# EAGLE board main (EAGLE 9.3.0), part 1 of 2
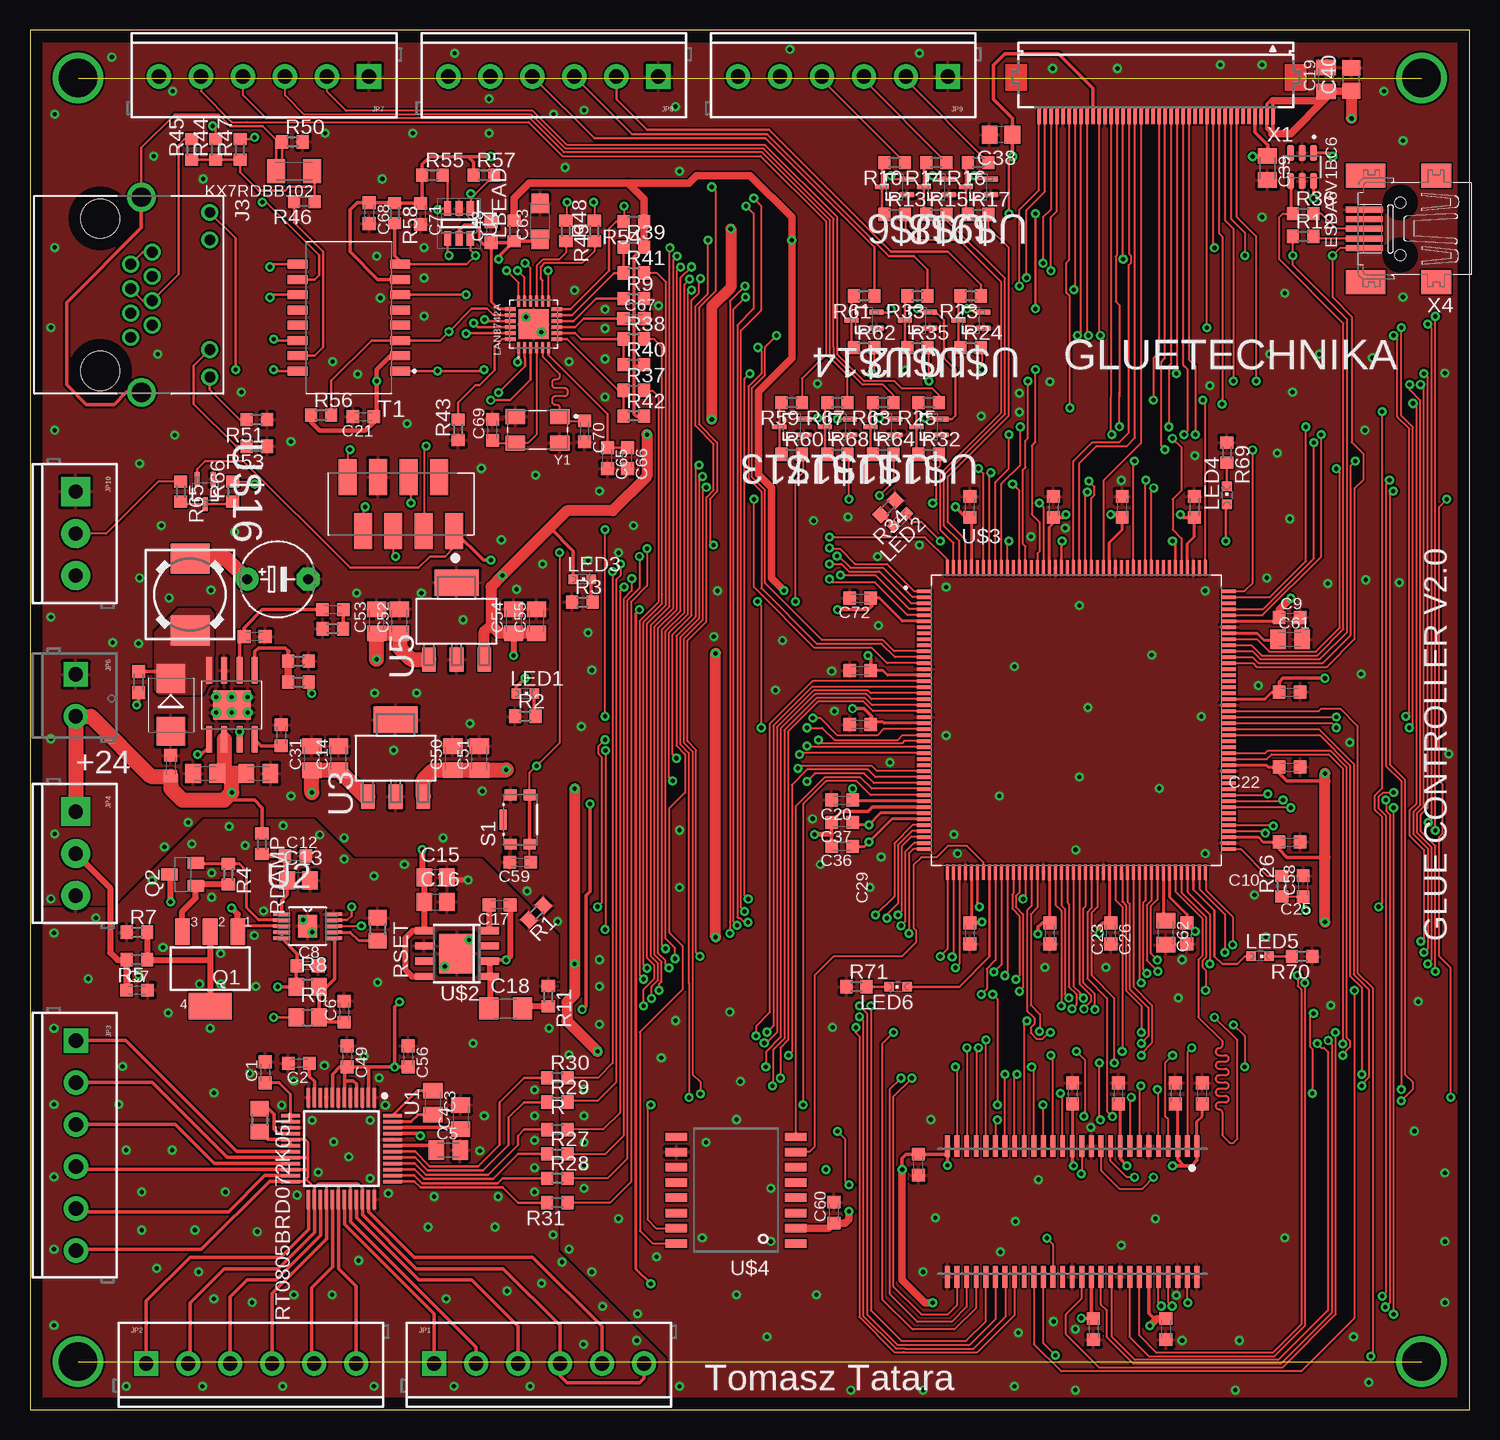
[diagram p9: board, top side]
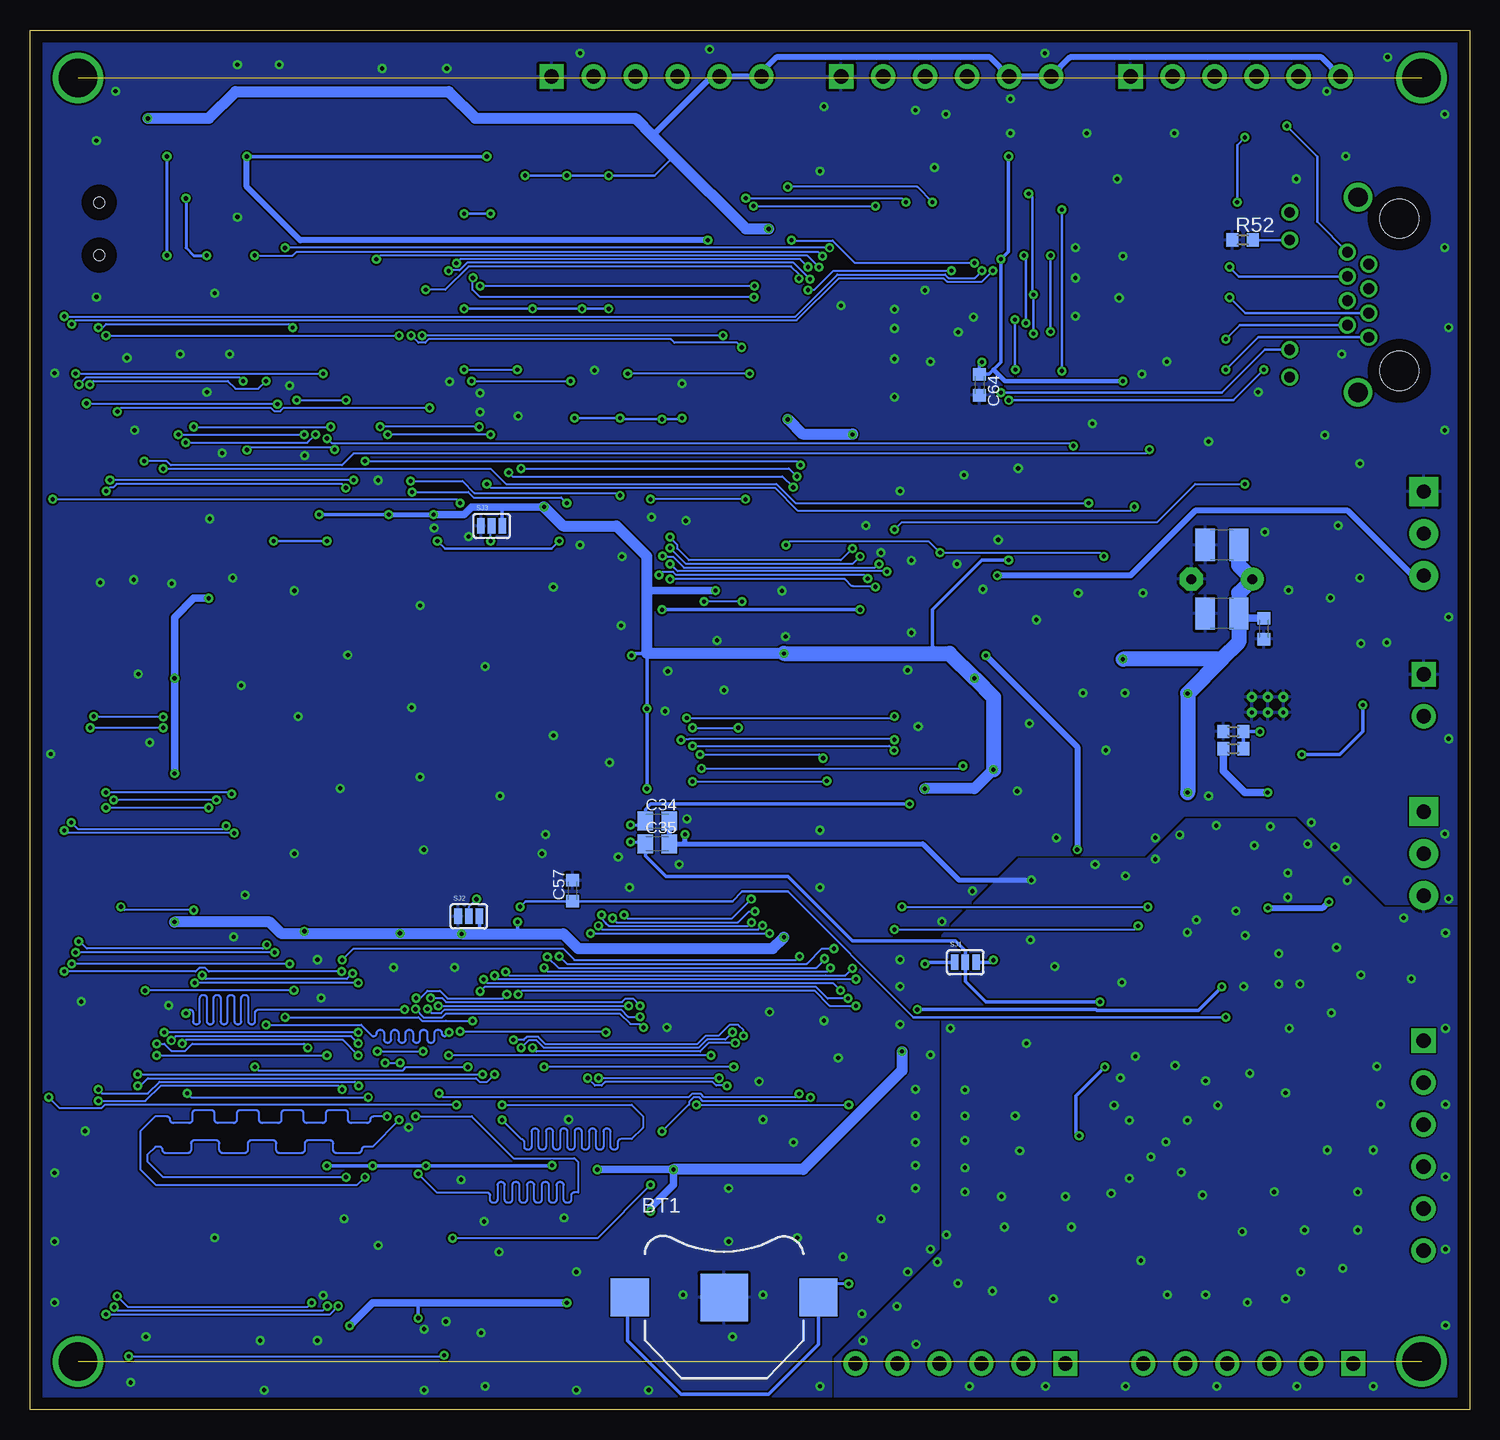
[diagram p10: board, bottom side, seen from below]

Size 120 x 115 mm. Coordinates in mm from the lower left corner, seen from the top.
Outline: 0,0 120,0 120,115 0,115 0,0
Copper layers (1*16): Top 0.035mm / dielectric 1.5mm / Bottom 0.035mm
Design rules "default": minimum track width 6mil, minimum drill 0.35mm, track to track 6mil, track to pad 6mil, pad to pad 6mil, via to via 6mil, smd to smd 6mil, copper to edge 40mil, drill to drill 6mil, minimum pad ring 10mil, minimum via ring 8mil, stop-mask expansion 4mil, vias tented up to drill 0mil, thermal gap 10mil

## Footprints (pad centres in the part's own frame; a part is rotated, then mirrored left to right if it is on the bottom)
BAT_3000TR = smd 3.18 x 3.18: 1 -7.87,0; 3 7.87,0 | smd 3.96 x 3.96: 2 0,0
C0603K = smd 1.05 x 1.08: 1 -0.875,0; 2 0.875,0
C0805K = smd 1.3 x 1.6: 1 -1,0; 2 1,0
C0805 = smd 1.3 x 1.5: 1 -0.95,0; 2 0.95,0
C1206 = smd 1.6 x 1.8: 1 -1.4,0; 2 1.4,0
SMC_A = smd 1.6 x 1.4: + -1.5,0; - 1.5,0
E5-6 = drill 0.813 pad 1.905: + -2.54,0 | drill 0.813 pad 1.905 octagon: - 2.54,0
C1210 = smd 1.6 x 2.7: 1 -1.4,0; 2 1.4,0
SMB = smd 2.4 x 2.4: A 2.2,0; C -2.2,0
SOT95P280X145-6N = smd 1.36 x 0.6: 1 -1.175,0.95; 2 -1.175,0; 3 -1.175,-0.95; 4 1.175,-0.95; 5 1.175,0; 6 1.175,0.95
AMPHENOL_RJHSE-5381 = drill 0.9: 1 3.55,2.54; 2 2.53,4.32; 3 1.52,2.54; 4 0.5,4.32; 5 -0.51,2.54; 6 -1.53,4.32; 7 -2.54,2.54; 8 -3.56,4.32; 9 6.86,9.14; 10 4.57,9.14; 11 -4.57,9.14; 12 -6.86,9.14 | drill 1.6: S1 8.13,3.43; S2 -8.13,3.43 | hole 3.25: 6.35,0; -6.35,0
SCREWTERMINAL-3.5MM-6 = drill 1.2 pad 2.032 square: 1 0,0 | drill 1.2 pad 2.032: 2 3.5,0; 3 7,0; 4 10.5,0; 5 14,0; 6 17.5,0
SCREWTERMINAL-3.5MM-3 = drill 1.2 pad 2.413 square: 1 0,0 | drill 1.2 pad 2.413: 2 3.5,0; 3 7,0
SCREWTERMINAL-3.5MM-2-NS = drill 1.2 pad 2.032 square: 1 0,0 | drill 1.2 pad 2.032: 2 3.5,0
C1206K = smd 1.5 x 2: 1 -1.5,0; 2 1.5,0
DR74 = smd 2.5 x 3.25: 1 -3,0; 2 3,0
QFN50P400X400X100-25N = smd 0.86 x 0.26: 1 -1.935,1.25; 2 -1.935,0.75; 3 -1.935,0.25; 4 -1.935,-0.25; 5 -1.935,-0.75; 6 -1.935,-1.25; 13 1.935,-1.25; 14 1.935,-0.75; 15 1.935,-0.25; 16 1.935,0.25; 17 1.935,0.75; 18 1.935,1.25 | smd 0.26 x 0.86: 7 -1.25,-1.935; 8 -0.75,-1.935; 9 -0.25,-1.935; 10 0.25,-1.935; 11 0.75,-1.935; 12 1.25,-1.935; 19 1.25,1.935; 20 0.75,1.935; 21 0.25,1.935; 22 -0.25,1.935; 23 -0.75,1.935; 24 -1.25,1.935 | smd 2.5 x 2.5: 25 0,0
R0603 = smd 1 x 1.1: 1 -0.85,0; 2 0.85,0
CHIPLED_0603 = smd 0.8 x 0.8: A 0,-0.75; C 0,0.75
SOT223 = smd 1.219 x 2.235: 1 -2.311,-3.099; 2 0,-3.099; 3 2.311,-3.099 | smd 3.6 x 2.2: 4 0,3.099
SOT23-BEC = smd 1 x 1.4: B -0.95,-1.1; C 0,1.1; E 0.95,-1.1
R0805 = smd 1.3 x 1.5: 1 -0.95,0; 2 0.95,0
SW_KMR221GLFS = smd 0.9 x 1: 1 -2.05,0.8; 2 -2.05,-0.8; 3 2.05,-0.8; 4 2.05,0.8 | smd 1.7 x 0.55: 5 0,1.425
SJ_3 = smd 0.635 x 1.27: 1 -0.889,0; 2 0,0; 3 0.889,0
XFMR_H1102NLT = smd 1.67 x 0.76: 1 -4.265,4.445; 2 -4.265,3.175; 3 -4.265,1.905; 4 -4.265,0.635; 5 -4.265,-0.635; 6 -4.265,-1.905; 7 -4.265,-3.175; 8 -4.265,-4.445; 9 4.265,-4.445; 10 4.265,-3.175; 11 4.265,-1.905; 12 4.265,-0.635; 13 4.265,0.635; 14 4.265,1.905; 15 4.265,3.175; 16 4.265,4.445
QFP50P900X900X160-48N = smd 1.6 x 0.3: 1 -4.25,2.75; 2 -4.25,2.25; 3 -4.25,1.75; 4 -4.25,1.25; 5 -4.25,0.75; 6 -4.25,0.25; 7 -4.25,-0.25; 8 -4.25,-0.75; 9 -4.25,-1.25; 10 -4.25,-1.75; 11 -4.25,-2.25; 12 -4.25,-2.75; 25 4.25,-2.75; 26 4.25,-2.25; 27 4.25,-1.75; 28 4.25,-1.25; 29 4.25,-0.75; 30 4.25,-0.25; 31 4.25,0.25; 32 4.25,0.75; 33 4.25,1.25; 34 4.25,1.75; 35 4.25,2.25; 36 4.25,2.75 | smd 0.3 x 1.6: 13 -2.75,-4.25; 14 -2.25,-4.25; 15 -1.75,-4.25; 16 -1.25,-4.25; 17 -0.75,-4.25; 18 -0.25,-4.25; 19 0.25,-4.25; 20 0.75,-4.25; 21 1.25,-4.25; 22 1.75,-4.25; 23 2.25,-4.25; 24 2.75,-4.25; 37 2.75,4.25; 38 2.25,4.25; 39 1.75,4.25; 40 1.25,4.25; 41 0.75,4.25; 42 0.25,4.25; 43 -0.25,4.25; 44 -0.75,4.25; 45 -1.25,4.25; 46 -1.75,4.25; 47 -2.25,4.25; 48 -2.75,4.25
SOP50P490X120-15N = smd 1.422 x 0.279: 1 -2.184,0.991; 2 -2.184,0.508; 3 -2.184,0; 4 -2.184,-0.508; 5 -2.184,-0.991; 6 2.184,-0.991; 7 2.184,-0.508; 8 2.184,0; 9 2.184,0.508; 10 2.184,0.991 | smd 1.575 x 1.88: 11 0,0
SOT230P700X180-4N = smd 2.032 x 1.143: 1 -3.2,2.311; 2 -3.2,0; 3 -3.2,-2.311 | smd 2.2 x 3.7: 4 3.2,0
SOT95P280X145-6N' = smd 1.2 x 0.6: 1 -1.25,0.95; 2 -1.25,0; 3 -1.25,-0.95; 4 1.25,-0.95; 5 1.25,0; 6 1.25,0.95
SOIC127P600X170-9N = smd 2.2 x 0.5: 1 -2.875,1.905; 2 -2.875,0.635; 3 -2.875,-0.635; 4 -2.875,-1.905; 5 2.875,-1.905; 6 2.875,-0.635; 7 2.875,0.635; 8 2.875,1.905 | smd 2.4 x 3.1: 9 0,0 | drill 0.33 pad 0.5: 10 -0.65,1.3; 11 0.65,1.3; 12 -0.65,0; 13 0.65,0; 14 -0.65,-1.3; 15 0.65,-1.3
TSOP54 = smd 0.4 x 1.8: 1 -10.4,-5.45; 2 -9.6,-5.45; 3 -8.8,-5.45; 4 -8,-5.45; 5 -7.2,-5.45; 6 -6.4,-5.45; 7 -5.6,-5.45; 8 -4.8,-5.45; 9 -4,-5.45; 10 -3.2,-5.45; 11 -2.4,-5.45; 12 -1.6,-5.45; 13 -0.8,-5.45; 14 0,-5.45; 15 0.8,-5.45; 16 1.6,-5.45; 17 2.4,-5.45; 18 3.2,-5.45; 19 4,-5.45; 20 4.8,-5.45; 21 5.6,-5.45; 22 6.4,-5.45; 23 7.2,-5.45; 24 8,-5.45; 25 8.8,-5.45; 26 9.6,-5.45; 27 10.4,-5.45; 28 10.4,5.45; 29 9.6,5.45; 30 8.8,5.45; 31 8,5.45; 32 7.2,5.45; 33 6.4,5.45; 34 5.6,5.45; 35 4.8,5.45; 36 4,5.45; 37 3.2,5.45; 38 2.4,5.45; 39 1.6,5.45; 40 0.8,5.45; 41 0,5.45; 42 -0.8,5.45; 43 -1.6,5.45; 44 -2.4,5.45; 45 -3.2,5.45; 46 -4,5.45; 47 -4.8,5.45; 48 -5.6,5.45; 49 -6.4,5.45; 50 -7.2,5.45; 51 -8,5.45; 52 -8.8,5.45; 53 -9.6,5.45; 54 -10.4,5.45
SOIC8 = smd 0.6 x 1.5: 1 -1.905,-2.75; 2 -0.635,-2.75; 3 0.635,-2.75; 4 1.905,-2.75; 5 1.905,2.75; 6 0.635,2.75; 7 -0.635,2.75; 8 -1.905,2.75 | smd 3.3 x 2.95: E 0,0
QFP50P2600X2600X160-176N = smd 0.3 x 1.3: BOOT0 -5.75,12.68; BYPASS_REG -9.25,-12.68; PA3 -9.75,-12.68; PA4 -8.25,-12.68; PA5 -7.75,-12.68; PA6 -7.25,-12.68; PA7 -6.75,-12.68; PA14 8.75,12.68; PA15 8.25,12.68; PB0 -5.25,-12.68; PB1 -4.75,-12.68; PB2/BOOT1 -4.25,-12.68; PB3 -3.25,12.68; PB4 -3.75,12.68; PB5 -4.25,12.68; PB6 -4.75,12.68; PB7 -5.25,12.68; PB8 -6.25,12.68; PB9 -6.75,12.68; PB10 6.25,-12.68; PB11 6.75,-12.68; PC4 -6.25,-12.68; PC5 -5.75,-12.68; PC10 7.75,12.68; PC11 7.25,12.68; PC12 6.75,12.68; PD0 6.25,12.68; PD1 5.75,12.68; PD2 5.25,12.68; PD3 4.75,12.68; PD4 4.25,12.68; PD5 3.75,12.68; PD6 2.25,12.68; PD7 1.75,12.68; PDR_ON -8.25,12.68; PE0 -7.25,12.68; PE1 -7.75,12.68; PE7 0.75,-12.68; PE8 1.25,-12.68; PE9 1.75,-12.68; PE10 3.25,-12.68; PE11 3.75,-12.68; PE12 4.25,-12.68; PE13 4.75,-12.68; PE14 5.25,-12.68; PE15 5.75,-12.68; PF11 -3.75,-12.68; PF12 -3.25,-12.68; PF13 -1.75,-12.68; PF14 -1.25,-12.68; PF15 -0.75,-12.68; PG0 -0.25,-12.68; PG1 0.25,-12.68; PG9 1.25,12.68; PG10 0.75,12.68; PG11 0.25,12.68; PG12 -0.25,12.68; PG13 -0.75,12.68; PG14 -1.25,12.68; PG15 -2.75,12.68; PH4 -10.75,-12.68; PH5 -10.25,-12.68; PH6 8.25,-12.68; PH7 8.75,-12.68; PH8 9.25,-12.68; PH9 9.75,-12.68; PH10 10.25,-12.68; PH11 10.75,-12.68; PI2 10.75,12.68; PI3 10.25,12.68; PI4 -9.25,12.68; PI5 -9.75,12.68; PI6 -10.25,12.68; PI7 -10.75,12.68; VCAP_1 7.25,-12.68; VDD@4 -8.75,-12.68; VDD@5 -2.25,-12.68; VDD@6 2.75,-12.68; VDD@7 7.75,-12.68; VDD@12 9.25,12.68; VDD@13 2.75,12.68; VDD@14 -2.25,12.68; VDD@15 -8.75,12.68; VSS@3 -2.75,-12.68; VSS@4 2.25,-12.68; VSS@10 9.75,12.68; VSS@11 3.25,12.68; VSS@12 -1.75,12.68 | smd 1.3 x 0.3: NRST -12.68,-4.25; PA0 -12.68,-8.75; PA1 -12.68,-9.25; PA2 -12.68,-9.75; PA8 12.68,4.25; PA9 12.68,4.75; PA10 12.68,5.25; PA11 12.68,5.75; PA12 12.68,6.25; PA13 12.68,6.75; PB12 12.68,-9.25; PB13 12.68,-8.75; PB14 12.68,-8.25; PB15 12.68,-7.75; PC0 -12.68,-4.75; PC1 -12.68,-5.25; PC2 -12.68,-5.75; PC3 -12.68,-6.25; PC6 12.68,2.25; PC7 12.68,2.75; PC8 12.68,3.25; PC9 12.68,3.75; PC13 -12.68,7.25; PC14 -12.68,6.75; PC15 -12.68,6.25; PD8 12.68,-7.25; PD9 12.68,-6.75; PD10 12.68,-6.25; PD11 12.68,-5.75; PD12 12.68,-5.25; PD13 12.68,-4.75; PD14 12.68,-3.25; PD15 12.68,-2.75; PE2 -12.68,10.75; PE3 -12.68,10.25; PE4 -12.68,9.75; PE5 -12.68,9.25; PE6 -12.68,8.75; PF0 -12.68,3.25; PF1 -12.68,2.75; PF2 -12.68,2.25; PF3 -12.68,1.75; PF4 -12.68,1.25; PF5 -12.68,0.75; PF6 -12.68,-0.75; PF7 -12.68,-1.25; PF8 -12.68,-1.75; PF9 -12.68,-2.25; PF10 -12.68,-2.75; PG2 12.68,-2.25; PG3 12.68,-1.75; PG4 12.68,-1.25; PG5 12.68,-0.75; PG6 12.68,-0.25; PG7 12.68,0.25; PG8 12.68,0.75; PH0 -12.68,-3.25; PH1 -12.68,-3.75; PH2 -12.68,-10.25; PH3 -12.68,-10.75; PH12 12.68,-10.75; PH13 12.68,8.75; PH14 12.68,9.25; PH15 12.68,9.75; PI0 12.68,10.25; PI1 12.68,10.75; PI8 -12.68,7.75; PI9 -12.68,5.75; PI10 -12.68,5.25; PI11 -12.68,4.75; VBAT -12.68,8.25; VCAP_2 12.68,7.25; VDD@1 -12.68,3.75; VDD@2 -12.68,-0.25; VDD@3 -12.68,-6.75; VDD@8 12.68,-9.75; VDD@9 12.68,-3.75; VDD@10 12.68,1.75; VDD@11 12.68,8.25; VDDA -12.68,-8.25; VREF -12.68,-7.75; VSS@1 -12.68,4.25; VSS@2 -12.68,0.25; VSS@5 12.68,-10.25; VSS@7 12.68,-4.25; VSS@8 12.68,1.25; VSS@9 12.68,7.75; VSSA -12.68,-7.25
SOIC16 = smd 0.7 x 1.8: 1 -4.445,-4.977; 2 -3.175,-4.977; 3 -1.905,-4.977; 4 -0.635,-4.977; 5 0.635,-4.977; 6 1.905,-4.977; 7 3.175,-4.977; 8 4.445,-4.977; 9 4.445,4.977; 10 3.175,4.977; 11 1.905,4.977; 12 0.635,4.977; 13 -0.635,4.977; 14 -1.905,4.977; 15 -3.175,4.977; 16 -4.445,4.977
MICROMATCH_8 = smd 1.5 x 3: 1 -5.715,2.25; 2 -4.445,-2.25; 3 -3.175,2.25; 4 -1.905,-2.25; 5 -0.635,2.25; 6 0.635,-2.25; 7 1.905,2.25; 8 3.175,-2.25
SOT65P210X110-3N = smd 1.168 x 0.406: 1 -1.041,0.66; 2 -1.041,-0.66; 3 1.041,0
FH12-40S-0.5SH = smd 0.3 x 1.3: 1 -9.75,3.25; 2 -9.25,3.25; 3 -8.75,3.25; 4 -8.25,3.25; 5 -7.75,3.25; 6 -7.25,3.25; 7 -6.75,3.25; 8 -6.25,3.25; 9 -5.75,3.25; 10 -5.25,3.25; 11 -4.75,3.25; 12 -4.25,3.25; 13 -3.75,3.25; 14 -3.25,3.25; 15 -2.75,3.25; 16 -2.25,3.25; 17 -1.75,3.25; 18 -1.25,3.25; 19 -0.75,3.25; 20 -0.25,3.25; 21 0.25,3.25; 22 0.75,3.25; 23 1.25,3.25; 24 1.75,3.25; 25 2.25,3.25; 26 2.75,3.25; 27 3.25,3.25; 28 3.75,3.25; 29 4.25,3.25; 30 4.75,3.25; 31 5.25,3.25; 32 5.75,3.25; 33 6.25,3.25; 34 6.75,3.25; 35 7.25,3.25; 36 7.75,3.25; 37 8.25,3.25; 38 8.75,3.25; 39 9.25,3.25; 40 9.75,3.25
32005-201 = smd 3.1 x 0.5: 1 3,1.6; 2 3,0.8; 3 3,0; 4 3,-0.8; 5 3,-1.6 | smd 2.5 x 2: M1 -3,-4.45; M2 -3,4.45 | smd 3.3 x 2: M3 2.9,4.45; M4 2.9,-4.45 | hole 0.9: 0,2.2; 0,-2.2
XTAL_ECS-250-20-30B-TR = smd 1.6 x 1.25: 1 -1.85,-1.1; 2 1.85,-1.1; 3 1.85,1.1; 4 -1.85,1.1

## Placement (x,y rotation side)
BT1  3000TR  [BAT_3000TR]  62.13,9.34 0 bottom
C1  1u  [C0603K]  19.62,28.11 90 top
C2  100n  [C0603K]  22.41,28.87 180 top
C3  10u  [C0805K]  33.59,25.57 270 top
C4  10u  [C0805K]  35.9,24.38 90 top
C5  10u  [C0805K]  34.86,21.63 0 top
C6  100n  [C0603K]  26.19,33.18 90 top
C7  10n  [C0603K]  8.92,34.96 0 top
C8  470n  [C0603K]  23.15,36.99 0 top
C9  100n  [C0603K]  105.01,66.04 0 top
C10  100n  [C0603K]  105.01,47.31 0 top
C11  100n  [C0603K]  85.01,39.69 270 top
C12  100n  [C0603K]  22.13,46.13 0 top
C13  10u  [C0805]  22.38,44.1 0 top
C14  10u  [C0805K]  25.72,54.29 90 top
C15  1u  [C0805]  33.81,44.36 0 top
C16  10u  [C0805]  33.81,42.32 0 top
C17  10n  [C0603K]  39.15,42.07 180 top
C18  22u  [C1206]  39.66,33.43 0 top
C19  2u2  [C0805K]  108.04,110.89 90 top
C20  100n  [C0603K]  67.71,50.8 180 top
C21  100n  [C0603K]  27.8,82.76 180 top
C22  100n  [C0603K]  105.01,59.8 0 top
C23  100n  [C0603K]  96.44,39.69 270 top
C24  100n  [C0603K]  97.08,75.25 90 top
C25  100n  [C0603K]  105.01,53.55 0 top
C26  100n  [C0603K]  90.09,39.69 270 top
C27  100n  [C0603K]  69.22,57.12 180 top
C28  100n  [C0603K]  78.34,75.25 90 top
C29  100n  [C0603K]  78.34,39.69 270 top
C30  100n  [C0603K]  85.33,75.25 90 top
C31  [C0805K]  23.5,54.29 90 top
C32  100n  [C0603K]  69.22,61.6 180 top
C33  100n  [C0603K]  91.04,75.25 90 top
C34  1u  [C0805K]  67.71,49.05 0 bottom
C35  1u  [C0805K]  67.71,47.15 0 bottom
C36  100n  [C0603K]  67.71,46.96 180 top
C37  100n  [C0603K]  67.71,48.93 180 top
C38  100n  [C0805]  80.95,106.27 180 top
C39  2u2  [C0805K]  103.16,103.49 270 top
C40  100n  [C0805]  110.14,110.89 90 top
C41  100n  [C0603K]  88.66,6.7 270 top
C42  100n  [C0603K]  94.69,6.7 270 top
C43  100n  [C0603K]  97.71,26.35 90 top
C44  100n  [C0603K]  74.06,20.41 270 top
C45  100n  [C0603K]  95.49,26.35 90 top
C46  100n  [C0603K]  86.92,26.35 90 top
C47  100n  [C0603K]  90.72,26.35 90 top
C48  100n  [C0603K]  38.45,98.15 90 top
C49  100n  [C0603K]  26.45,29.43 270 top
C50  10u  [C0805K]  35.24,54.29 90 top
C51  2u2  [C0805K]  37.47,54.29 90 top
C52  10u  [C0805K]  30.8,65.72 90 top
C53  [C0805K]  28.89,65.72 90 top
C54  10u  [C0805K]  40.32,65.72 90 top
C55  2u2  [C0805K]  42.23,65.72 90 top
C56  100n  [C0603K]  31.53,29.43 270 top
C57  100n  [C0603K]  74.77,43.24 90 bottom
C58  100n  [C0603K]  106.13,43.62 90 top
C59  100n  [C0603K]  40.86,45.63 180 top
C60  100n  [C0603K]  67,16.41 90 top
C61  2u2  [C0805K]  105.05,64.2 0 top
C62  2u2  [C0805K]  94.68,39.73 270 top
C63  [SMC_A]  42.51,99.05 90 top
C64  100n  [C0603K]  40.85,85.42 270 bottom
C65  1u  [C0603K]  48.13,79.31 270 top
C66  470p  [C0603K]  49.8,79.31 270 top
C67  100n  [C0603K]  50.33,90.92 0 top
C68  100n  [C0603K]  28.29,99.73 270 top
C69  18p  [C0603K]  38.55,81.67 90 top
C70  18p  [C0603K]  46.23,81.53 270 top
C71  100n  [C0603K]  32.57,99.66 270 top
C72  100n  [C0603K]  69.22,67.63 180 top
C84  10n  [C0603K]  20.95,56.2 90 top
C85  4u7  [C0805K]  19.05,53.02 0 top
C86  4u7  [C0805K]  14.61,53.02 180 top
C87  100n  [C0603K]  11.75,53.66 90 top
C88  2n2  [C0603K]  25.24,66.67 0 top
C89  22n  [C0603K]  18.73,64.45 0 top
C90  100n  [C0603K]  9.05,60.64 90 top
C91  [E5-6]  20.64,69.22 0 top
C92  47u  [C1210]  20.64,72.07 180 bottom
C93  1u  [C0603K]  17.14,65.09 270 bottom
C94  47u  [C1210]  20.64,66.36 180 bottom
D1  CDBC540-G  [SMB]  11.75,58.74 270 top
ESDA6V1BC6  ESDA6V1SC6  [SOT95P280X145-6N]  106.05,103.58 270 top
J3  RJHSE-5381  [AMPHENOL_RJHSE-5381]  5.86,92.93 270 top
JP1  [SCREWTERMINAL-3.5MM-6]  33.69,3.84 0 top
JP2  [SCREWTERMINAL-3.5MM-6]  9.68,3.84 0 top
JP3  [SCREWTERMINAL-3.5MM-6]  3.84,30.76 270 top
JP4  [SCREWTERMINAL-3.5MM-3]  3.81,49.85 270 top
JP6  [SCREWTERMINAL-3.5MM-2-NS]  3.81,61.28 270 top
JP7  [SCREWTERMINAL-3.5MM-6]  28.26,111.12 180 top
JP8  [SCREWTERMINAL-3.5MM-6]  52.39,111.12 180 top
JP9  [SCREWTERMINAL-3.5MM-6]  76.52,111.12 180 top
JP10  [SCREWTERMINAL-3.5MM-3]  3.81,76.52 270 top
KX7RDBB102  1n  [C1206K]  22.02,103.21 180 top
L1  ASPI-0630LR-4R7M-T15  [DR74]  13.34,67.94 90 top
LAN8742A  LAN8720A-CP  [QFN50P400X400X100-25N]  41.98,90.47 90 top
LBEAD  742863160  [R0603]  40.35,98.25 90 top
LED1  [CHIPLED_0603]  41.27,59.69 270 top
LED2  [CHIPLED_0603]  72.53,74.17 135 top
LED3  [CHIPLED_0603]  46.04,69.22 270 top
LED4  [CHIPLED_0603]  99.77,76.2 0 top
LED5  [CHIPLED_0603]  102.55,37.78 270 top
LED6  [CHIPLED_0603]  72.39,35.24 90 top
Q1  BSP170P  [SOT223]  15.02,36.74 180 top
Q2  MMBT2907ALT1SMD  [SOT23-BEC]  12.73,44.61 90 top
R  100  [R0603]  43.97,23.34 0 top
R1  0  [R0603]  42.21,41.41 225 top
R2  10k  [R0603]  41.27,57.78 0 top
R3  10k  [R0603]  46.04,67.31 0 top
R4  15  [R0603]  16.54,44.61 270 top
R5  10k  [R0603]  8.92,37.5 180 top
R6  5.11k 0.1  [R0805]  23.15,32.67 0 top
R7  500  [R0603]  8.92,39.78 0 top
R8  20.5k 0.1  [R0805]  23.15,35.21 0 top
R9  10k  [R0603]  50.33,92.6 0 top
R10  1k  [R0603]  72.07,103.95 180 top
R11  0.25  [R0603]  43.21,34.45 270 top
R12  22  [R0603]  106.12,97.79 0 top
R13  10  [R0603]  72.07,99.63 0 top
R14  1k  [R0603]  75.56,103.95 180 top
R15  10  [R0603]  75.56,99.63 0 top
R16  1k  [R0603]  79.06,103.95 180 top
R17  10  [R0603]  79.06,99.63 0 top
R18  330k  [R0603]  19.68,55.09 180 bottom
R19  45.3k  [R0603]  19.68,56.52 0 bottom
R20  16k  [R0603]  22.38,60.64 0 top
R21  2k67  [R0603]  22.38,62.39 180 top
R22  37k4  [R0603]  25.24,65.09 180 top
R23  1k  [R0603]  78.42,92.84 180 top
R24  10  [R0603]  78.42,88.52 0 top
R25  1k  [R0603]  74.93,83.95 180 top
R26  10k  [R0603]  104.35,43.62 90 top
R27  100  [R0603]  43.97,21.31 0 top
R28  100  [R0603]  43.97,19.27 0 top
R29  100  [R0603]  43.97,25.62 0 top
R30  100  [R0603]  43.97,27.66 0 top
R31  100  [R0603]  43.97,17.24 180 top
R32  10  [R0603]  74.93,79.63 0 top
R33  1k  [R0603]  73.98,92.84 180 top
R34  10k  [R0603]  71.52,75.18 225 top
R35  10  [R0603]  73.98,88.52 0 top
R36  22  [R0603]  106.12,99.69 0 top
R37  33  [R0603]  50.33,84.96 0 top
R38  33  [R0603]  50.33,89.25 0 top
R39  10k  [R0603]  50.33,96.89 0 top
R40  10k  [R0603]  50.33,87.1 0 top
R41  33  [R0603]  50.33,94.74 0 top
R42  10k  [R0603]  50.33,82.81 0 top
R43  12k1  [R0603]  35.69,81.67 90 top
R44  75  [R0603]  15.49,105.04 90 top
R45  75  [R0603]  13.47,105.04 90 top
R46  75  [R0603]  22.88,100.7 180 top
R47  75  [R0603]  17.52,105.04 90 top
R48  33  [R0603]  47.04,98.25 90 top
R49  0  [R0603]  44.67,98.25 270 top
R50  0  [R0603]  21.89,105.67 0 top
R51  270  [R0603]  18.91,82.52 180 top
R52  270  [R0603]  18.91,97.5 0 bottom
R53  10k  [R0603]  18.91,80.3 180 top
R54  1k5  [R0603]  50.33,99.03 180 top
R55  50  [R0603]  33.56,102.9 0 top
R56  50  [R0603]  24.27,82.89 0 top
R57  50  [R0603]  37.84,102.9 0 top
R58  50  [R0603]  30.4,99.73 270 top
R59  1k  [R0603]  63.5,83.95 180 top
R60  10  [R0603]  63.5,79.63 0 top
R61  1k  [R0603]  69.53,92.84 180 top
R62  10  [R0603]  69.53,88.52 0 top
R63  1k  [R0603]  71.12,83.95 180 top
R64  10  [R0603]  71.12,79.63 0 top
R65  1k  [R0603]  12.57,76.52 270 top
R66  10  [R0603]  16.89,76.52 90 top
R67  1k  [R0603]  67.31,83.95 180 top
R68  10  [R0603]  67.31,79.63 0 top
R69  10k  [R0603]  99.77,79.77 270 top
R70  10k  [R0603]  106.05,37.78 180 top
R71  10k  [R0603]  68.9,35.24 0 top
RDAMP  5  [R0603]  19.34,47.15 270 top
RSET  1k650 0.1  [R0805]  28.99,40.04 270 top
RT0805BRD072K05L  2050 0.1%  [R0805]  19.14,24.13 270 top
S1  KMR221GLFS  [SW_KMR221GLFS]  40.86,49.18 90 top
SJ1  [SJ_3]  42.03,37.28 0 bottom
SJ2  [SJ_3]  83.42,41.12 0 bottom
SJ3  [SJ_3]  81.52,73.66 0 bottom
T1  H1102NLT  [XFMR_H1102NLT]  26.58,91.02 180 top
U1  LTC2983CLX#PBF  [QFP50P900X900X160-48N]  25.97,21.76 270 top
U2  XTR111AIDGQR  [SOP50P490X120-15N]  23.15,40.29 0 top
U3  MCP1826S-5002E/DB  [SOT230P700X180-4N]  30.48,54.29 90 top
U4  USBLC6-4SC6  [SOT95P280X145-6N']  35.76,98.87 270 top
U5  MCP1826S-5002E/DB  [SOT230P700X180-4N]  35.56,65.72 90 top
U6  TPS54531DDA  [SOIC127P600X170-9N]  16.83,58.74 90 top
U$1  IS45S16400J  [TSOP54]  86.88,16.51 180 top
U$2  IFX5444  [SOIC8]  35.59,38.01 90 top
U$3  STM32F429_176  [QFP50P2600X2600X160-176N]  87.23,57.47 0 top
U$4  S25FLX  [SOIC16]  58.86,18.29 90 top
U$5  MICROMATCH_8  [MICROMATCH_8]  29.66,75.48 180 top
U$6  BAS40W-04  [SOT65P210X110-3N]  72.07,101.92 180 top
U$8  BAS40W-04  [SOT65P210X110-3N]  75.56,101.92 180 top
U$9  BAS40W-04  [SOT65P210X110-3N]  79.06,101.92 180 top
U$10  BAS40W-04  [SOT65P210X110-3N]  78.42,90.81 180 top
U$11  BAS40W-04  [SOT65P210X110-3N]  74.93,81.92 180 top
U$12  BAS40W-04  [SOT65P210X110-3N]  73.98,90.81 180 top
U$13  BAS40W-04  [SOT65P210X110-3N]  63.5,81.92 180 top
U$14  BAS40W-04  [SOT65P210X110-3N]  69.53,90.81 180 top
U$15  BAS40W-04  [SOT65P210X110-3N]  71.12,81.92 180 top
U$16  BAS40W-04  [SOT65P210X110-3N]  14.61,76.52 270 top
U$17  BAS40W-04  [SOT65P210X110-3N]  67.31,81.92 180 top
X1  FH12-40S-0.5SH  [FH12-40S-0.5SH]  93.86,111.05 180 top
X4  MINI-USB-32005-201  [32005-201]  114.22,98.42 180 top
Y1  ECS-250-20-30B-TR  [XTAL_ECS-250-20-30B-TR]  42.31,81.67 180 top

## Tracks (layer width: path | path; a pad name or v marks a point on that pad's centre or on a via)
6V  (via drill 0.35)
  Top 0.305: R20.2 23.23,59.95 v23.5,59.69
  Top 1.27: L1.2 16.37,70.94 C91.+ | v28.89,62.55 C53.1 C52.1 30.8,63.5 31.77,62.52 U5.1 | v23.5,51.44 C31.1 C14.1 27.92,51.09 U3.1
  Bottom 0.61: C93.1 18.84,65.96 C94.1
  Bottom 1.27: C92.1 19.24,70.36 C91.+ 19.24,68.08 C94.1 19.24,63.95 20.64,62.55 | 20.64,62.55 v28.89,62.55 | 20.64,62.55 v23.5,59.69 v23.5,51.44
!EN  (via drill 0.35)
  Top 0.305: U6.3 v17.46,56.5
  Bottom 0.305: R18.1 R19.2 17.48,56.52 v17.46,56.5
+3V3  (via drill 0.35)
  Top 0.203: LAN8742A.9 45.45,90.22 46.16,90.92 C67.1 | U$13.2 65.56,82.58 v65.64,82.65 | v67.31,82.55 68.33,82.55 U$17.2 | v70.8,82.65 72.09,82.65 U$15.2 | v74.61,82.65 74.69,82.58 U$11.2 76.86,82.58 77.15,82.87 77.15,86.68 76.2,87.63 76.2,90.81 75.54,91.47 U$12.2 74.27,91.47 v73.98,91.76 | v71.75,91.76 71.44,91.44 70.6,91.44 U$14.2 | v78.11,91.76 78.42,91.76 78.74,91.44 79.44,91.44 U$10.2 | v83.82,91.76 v83.82,99.69 | v81.6,99.69 81.6,104.14 v81.92,104.46 | U$16.2 13.95,78.4 14.61,79.06 17.78,79.06 26.67,70.17 32.38,70.17 33.34,71.12 34.61,71.12 35.37,71.88 U$5.1
  Top 0.254: U$3.VDD@11 103.81,65.72 C9.1 | U$3.VDD@10 102.95,59.22 103.53,59.8 C22.1 | U$3.VDD@9 103.05,53.72 103.21,53.55 C25.1 | U$3.VDD@8 102.38,47.72 102.79,47.31 C10.1 | U$3.VDD@12 96.48,72.19 97.08,72.78 C24.1 | U$3.VDD@13 89.98,72.28 91.04,73.34 C33.1 | C28.1 78.48,74.23 U$3.VDD@15 | U$3.VDD@5 84.98,40.59 C11.1 | C46.1 86.88,25.44 U$1.14 | U$1.9 90.88,25.32 C47.1 | U$1.3 95.68,25.29 C45.1 | U$1.1 97.28,24.02 97.71,24.45 C43.1 | U$3.VDD@4 78.48,40.7 C29.1 | U$3.VDD@6 89.98,40.67 C26.1 | U$3.VDD@7 94.98,42.73 96.44,41.27 C23.1 | U$3.VDD@3 68.66,50.72 C20.1 | U$3.VDD@1 71.5,61.22 71.12,61.6 C32.1 | U$3.VDD@2 71.21,57.22 71.12,57.31 70.28,57.31 C27.1 | U$3.VDD@14 84.98,73.55 85.33,73.9 C30.1
  Top 0.305: C20.1 v68.58,51.75 | C11.1 84.38,40.56 84.03,40.21 v84.03,39.65 | C22.1 104.14,60.64 104.46,60.96 v107.95,60.96 | C25.1 104.14,53.02 104.78,52.39 107.95,52.39 | C10.1 104.14,46.67 104.78,46.04 107.95,46.04 | C26.1 89.46,40.56 89.16,40.27 v89.16,39.7 | C27.1 70.09,57.71 70.17,57.78 69.53,58.42 v68.58,58.42 | U$1.43 88.48,7.75 C41.1 88.61,7.62 v87.63,7.62 | U$1.49 93.28,8 93.71,7.57 94.61,7.57 C42.1 | C24.1 96.12,74.37 v95.89,74.61 | U$1.9 90.88,20.88 v91.44,20.32 | U$1.3 95.68,20.84 96.2,20.32 | 96.2,20.32 96.84,20.32 97.28,20.76 U$1.1 | 96.2,20.32 v95.25,20.32 | v87,20.32 86.88,20.43 U$1.14 | 76.48,21.27 U$1.27 | 76.48,21.27 74.07,21.27 C44.1 74.04,21.27 73.03,21.27 72.71,20.95 v72.71,20 | v76.48,20.35 76.48,21.27 | X1.4 102.11,106.48 103.19,105.41 103.19,104.52 C39.1 103.13,104.46 v101.92,104.46 | LED1.A 40.52,60.21 v41.27,60.96 | X1.31 88.61,110.14 85.72,113.03 81.28,113.03 80.33,112.08 80.33,109.22 81.92,107.63 81.92,106.28 C38.1 81.9,104.47 v81.92,104.46 | R39.2 50.37,96.08 50.37,90.81 | R42.2 50.53,82.81 50.37,82.98 50.37,87 | 50.37,90.81 50.37,87 | R40.2 51.07,87 50.37,87 | C67.1 49.57,90.81 50.37,90.81 | U$5.1 37.8,70.8 v38.42,70.8 | C29.1 79.27,40.56 v79.35,40.64 | C32.1 70.09,62.62 v69.85,62.87 | C28.1 78.03,74.37 v77.15,75.25 | C33.1 90.8,74.61 v90.09,74.61 | C30.1 86.12,74.37 v86.36,74.61 | C23.1 v97.13,39.87
  Top 0.61: v105.09,67.63 104.14,66.67 C9.1 | U$4.2 66.58,15.11 C60.1 67.93,15.54 68.26,15.88 v68.26,16.51 | v72.71,20 72.71,10.79 74.61,8.89 v75.25,8.89 | v93.34,6.99 93.93,7.57 94.61,7.57 | LBEAD.2 40.35,100.99 41.59,102.23 49.85,102.23 | 49.85,102.23 51.17,100.91 R54.1 R39.2 | 49.85,102.23 54.93,102.23 55.56,102.87 60.01,102.87 63.5,99.38 v63.5,97.47 63.5,87.63 60.72,84.84 60.72,77.95 61.81,76.85 61.81,69.32 v62.87,68.26
  Top 0.914: v107.95,40.64 107.95,46.04 107.95,52.39 v107.95,53.02 | v57.15,39.37 v57.15,63.02 | v45.4,51.75 v45.4,37.15 45.4,34.61 44.77,33.97 44.77,32.38 v47.31,29.84
  Top 1.27: U3.3 32.79,52.48 33.61,53.29 C50.1 C51.1 39.64,53.29 v39.69,53.34
  Bottom 0.203: v65.64,82.65 65.73,82.55 v67.31,82.55 70.7,82.55 v70.8,82.65 v74.61,82.65 | v71.75,91.76 v73.98,91.76 v78.1,91.76 v78.11,91.76 v83.82,91.76 | v83.82,99.69 v81.6,99.69
  Bottom 0.305: v89.16,39.7 89.22,39.65 | v68.58,51.75 v68.58,58.42 68.58,63.02 69.69,63.02 v69.85,62.87 | v95.89,74.61 v90.09,74.61 | v95.25,20.32 v91.44,20.32 v87,20.32 76.51,20.32 v76.48,20.35 | v87.63,7.62 87.63,8.89 | v81.92,104.46 v101.92,104.46 | v38.42,70.8 40.64,70.8 44.77,66.67 44.77,63.02 | SJ1.1 45.27,37.28 v45.4,37.15 | SJ2.3 82.53,39.66 82.55,39.65 | SJ3.3 80.63,75.23 80.64,75.25 | v79.35,40.64 79.38,40.62 79.38,39.65 | v97.13,39.87 97.16,39.84 97.16,39.65
  Bottom 0.406: v90.09,74.61 v86.36,74.61
  Bottom 0.508: v63.5,97.47 97.47,97.47 101.92,101.92 v101.92,104.46
  Bottom 0.61: v107.95,53.02 v107.95,60.96 107.95,66.04 106.36,67.63 v105.09,67.63 | v86.36,74.61 83.82,74.61 83.19,75.25 80.64,75.25 v77.15,75.25 | v72.71,20 v66.36,20 66.36,18.73 68.26,16.83 v68.26,16.51 | v75.25,8.89 87.63,8.89 91.44,8.89 v93.34,6.99 | v62.87,68.26 68.26,68.26 68.58,67.94
  Bottom 0.914: v57.15,63.02 68.58,63.02 68.58,67.94 68.58,71.12 71.12,73.66 75.56,73.66 v77.15,75.25 | v107.95,40.64 100.01,40.64 99.02,39.65 97.16,39.65 89.22,39.65 v84.03,39.65 82.55,39.65 79.38,39.65 75.53,39.65 74.3,38.42 58.1,38.42 v57.15,39.37 | v39.69,53.34 41.27,51.75 v45.4,51.75 | v47.31,29.84 47.31,28.26 55.56,20 v66.36,20
  Bottom 1.27: v57.15,63.02 44.77,63.02 43.34,63.02 v41.27,60.96 39.69,59.37 v39.69,53.34
+5V  (via drill 0.35)
  Top 0.203: U$6.2 72.05,102.58 v71.75,102.87 | v75.25,102.87 75.54,102.58 U$8.2 | v78.74,102.87 79.06,102.55 80.07,102.55 U$9.2
  Top 0.305: LED3.A 45.29,71.55 43.34,73.5 | X1.2 103.11,108.83 103.5,109.22 103.61,109.11 X1.1 103.61,106.47 103.5,106.36 103.11,106.75 X1.2
  Top 0.508: 32.86,39.93 U$2.5 | 32.86,39.93 31.93,39.93 31.27,39.28 31.27,36.67 31.84,36.1 U$2.8 | 32.86,39.93 C16.1 C15.1 32.7,44.52 v32.7,46.67 | C54.1 v40.32,62.87
  Top 0.61: 103.61,109.11 107.27,109.11 107.98,109.82 | 107.98,109.82 C19.1 110.09,109.89 C40.1 | 103.5,106.36 105.09,106.36 107.98,109.25 107.98,109.82
  Top 0.914: C40.1 110.14,107.67 v110.17,107.63 | v58.42,98.42 58.42,93.53 56.83,91.94 v56.83,82.55 | v51.44,81.28 51.44,77.79 48.58,74.93 44.77,74.93 43.34,73.5 v39.37,69.53 38.42,68.58 38.42,65.41 | 38.42,65.41 39.1,64.72 C54.1 C55.1 | U5.3 37.87,64.86 38.42,65.41
  Bottom 0.203: v78.74,102.87 v75.25,102.87 v71.75,102.87 67.95,102.87 66.36,104.46
  Bottom 0.508: JP9.6 59.37,111.12 | 59.37,111.12 JP9.5 63.18,111.12 68.1,106.2 | 59.37,111.12 57.78,112.71 39.98,112.71 JP8.5 JP8.6 33.3,112.71 12.35,112.71 JP7.6 | JP10.3 4.75,69.52 10.16,74.93 22.86,74.93 28.26,69.53 v39.37,69.53 | v40.32,62.87 32.7,55.24 v32.7,46.67
  Bottom 0.914: v110.17,107.63 105.09,107.63 102.87,109.86 85.09,109.86 82.87,107.63 69.53,107.63 68.1,106.2 66.36,104.46 60.33,98.42 v58.42,98.42 | v56.83,82.55 55.61,81.32 51.44,81.32 v51.44,81.28
+24V  (via drill 0.35)
  Top 0.305: 16.19,55.24 U6.2 | RDAMP.1 19.37,48.03 19.37,50.16 18.73,50.8 16.19,50.8
  Top 0.508: 19.17,48.17 RDAMP.1
  Top 1.27: U6.2 16.19,53.61 C86.1 16.83,53.02 | C85.1 16.83,53.02 | JP4.1 JP6.2 5.09,57.78 10.08,52.78 C87.1 11.75,51.75 12.7,50.8 16.19,50.8 v16.83,51.44 16.83,53.02
  Bottom 0.61: R18.2 20.54,53.24 18.73,51.44 v16.83,51.44
CH1
  Top 0.305: U1.19 17.23,21.51 7.97,30.76 JP3.1
CH2
  Top 0.305: U1.21 15.37,20.51 12.11,23.76 JP3.3
CH3
  Top 0.305: U1.23 19.57,19.51 16.54,16.48 4.12,16.48 JP3.5
CH4
  Top 0.305: U1.25 23.22,15.03 20.89,12.7 13.34,12.7 9.68,9.05 JP2.1
CH5
  Top 0.305: U1.27 24.22,14.51 20.51,10.79 18.1,10.79 16.68,9.38 JP2.3
CH6
  Top 0.305: U1.29 25.22,11.89 23.5,10.16 23.5,4.76 23.81,4.45 23.81,3.97 JP2.5
CH7
  Top 0.305: U1.31 26.22,15.44 33.69,7.97 JP1.1
CH8
  Top 0.305: U1.33 27.22,15.96 32.39,10.79 36.83,10.79 40.69,6.94 JP1.3
CH9
  Top 0.305: U1.35 28.22,16.48 32.01,12.7 41.91,12.7 47.69,6.92 JP1.5
COIN_BAT  (via drill 0.35)
  Top 0.254: U$3.VBAT 72.71,65.72 70.8,67.63 C72.1 | v50.8,66.67 50.48,66.36 50.48,11.75 v51.75,10.48
  Top 0.305: v67.31,66.67 69.85,66.67 70.17,66.99 70.09,67.07 C72.1
  Bottom 0.254: v51.75,10.48 54.93,10.48 | 54.93,10.48 55.24,10.79 | 54.93,10.48 54.27,9.81 BT1.3
  Bottom 0.305: v50.8,66.67 v67.31,66.67 | BT1.3 54.27,5.42 58.42,1.27 65.72,1.27 70.17,5.71 70.17,9.18 BT1.1
CTP_INT  (via drill 0.35)
  Top 0.152: U$3.PH3 73.62,46.72 73.26,46.35 v73.26,39.69 | v58.34,39.69 58.38,39.73 58.38,40.08 58.34,40.12 58.34,40.62 58.35,40.63 58.35,92.41 v59.61,93.66 | v82.47,93.66 82.47,100.01 84.11,101.66 X1.40
  Bottom 0.152: v73.26,39.69 v58.34,39.69 | v59.61,93.66 v82.47,93.66
CTP_RST  (via drill 0.35)
  Top 0.152: U$3.PH2 73.69,47.22 72.96,46.48 72.96,40.67 v72.62,40.33 | v58.95,40.37 58.66,40.66 58.66,91.74 v59.65,92.74 | v83.08,94.34 83.08,99.98 84.61,101.52 X1.39
  Bottom 0.152: v72.62,40.33 72.3,40.01 59.31,40.01 v58.95,40.37 | v59.65,92.74 82.5,92.74 83.11,93.34 83.11,94.31 v83.08,94.34
CTP_SCL  (via drill 0.35)
  Top 0.152: U$3.PH4 76.48,38.38 v75.88,37.78 | v52.97,38.42 52.67,38.72 52.67,65 54.24,66.58 54.24,94.34 v55.15,95.25 | X1.38 85.11,100.04 84.45,99.38 v84.45,95.57
  Bottom 0.152: v75.88,37.78 75.25,37.15 55.24,37.15 53.98,38.42 v52.97,38.42 | v55.15,95.25 55.8,95.9 84.12,95.9 v84.45,95.57
CTP_SDA  (via drill 0.35)
  Top 0.152: U$3.PH5 76.98,37.85 v76.88,37.74 | v53.77,37.58 53.77,38.47 52.97,39.27 52.97,64.88 54.55,66.45 54.55,93.79 v54.99,94.23 | v85.1,94.92 85.1,99.39 85.61,99.9 X1.37
  Bottom 0.152: v76.88,37.74 75.95,36.82 54.44,36.82 53.77,37.48 v53.77,37.58 | v54.99,94.23 56.35,95.59 83.57,95.59 84.2,94.96 85.06,94.96 v85.1,94.92
ENCODER1_0
  Top 0.152: U$3.PI4 77.98,72.51 76.52,73.98 76.52,77.79 81.6,82.87 81.6,96.84 79.91,98.53 R17.2
ENCODER1_A
  Top 0.152: U$3.PI6 76.98,72.24 75.89,73.33 75.89,78.03 80.96,83.09 80.96,93.98 77.47,97.47 73.98,97.47 73.03,98.42 73.03,99.53 R13.2
ENCODER1_B
  Top 0.152: U$3.PI5 77.47,72.39 76.2,73.66 76.2,77.9 81.28,82.98 81.28,94.3 76.42,99.16 R15.2
ENCODER2_0  (via drill 0.35)
  Top 0.152: v74.93,85.72 74.93,88.42 R35.2 | v83.19,85.72 83.19,80.96 82.98,80.76 82.98,78.54 82.79,78.34 82.79,72.15 82.98,71.96 U$3.PB5
  Bottom 0.152: v83.19,85.72 v74.93,85.72
ENCODER2_A  (via drill 0.35)
  Top 0.152: v83.82,86.68 83.82,80.64 83.5,80.33 83.5,74.61 84.14,73.98 84.14,71.52 83.98,71.36 83.98,71.35 U$3.PB3 | v79.38,86.68 79.38,88.42 R24.2
  Bottom 0.152: v83.82,86.68 v79.38,86.68
ENCODER2_B  (via drill 0.35)
  Top 0.152: U$3.PA0 73.57,48.72 72.04,47.19 72.04,42.78 v70.48,41.22 | v59.87,42.55 59.57,42.85 59.57,85.92 v60.01,86.36 | v70.17,86.36 70.38,86.58 R62.2
  Bottom 0.152: v70.48,41.22 70.18,40.92 61.5,40.92 v59.87,42.55 | v60.01,86.36 v70.17,86.36
ETH_CRS_DV  (via drill 0.35)
  Top 0.152: U$3.PA7 80.48,37.46 79.76,36.74 79.76,35.07 v79.3,34.61 | R41.2 52.26,94.74 53.02,93.98 53.01,93.97 53.01,67.07 51.45,65.51 51.45,37.64 52.05,37.04 52.05,35.93 51.14,35.02 v51.14,33.66
  Bottom 0.152: v79.3,34.61 78.98,34.92 54.61,34.92 53.34,33.66 v51.14,33.66
ETH_LED1  (via drill 0.35)
  Top 0.203: LAN8742A.3 41.73,85.86 40.01,84.14 v38.42,84.14 v38.41,84.13 | v17.14,86.68 17.14,97.64 J3.12
  Bottom 0.203: v38.41,84.13 19.69,84.13 v17.14,86.68
ETH_LED2  (via drill 0.35)
  Top 0.203: LAN8742A.2 41.23,87.67 41.27,87.63 41.27,87 v39.05,84.77 | R53.2 17.17,80.3 13.65,83.82 13.65,87.02 J3.10
  Bottom 0.203: v39.05,84.77 20.64,84.77 17.05,88.36 J3.10
ETH_MDC  (via drill 0.35)
  Top 0.152: v53.58,52.39 53.28,52.69 53.28,64.75 54.85,66.33 54.85,93.02 v55.15,93.33 | LAN8742A.13 43.23,94.88 v43.18,94.93 | U$3.PC1 70.34,52.22 69.53,53.02 65.43,53.02 v64.77,52.36
  Bottom 0.152: v64.77,52.36 53.61,52.36 v53.58,52.39 | v55.15,93.33 55.13,93.34 54.61,93.34 53.02,94.93 v43.18,94.93
ETH_MDIO  (via drill 0.35)
  Top 0.152: U$3.PA2 73.44,47.72 72.65,46.94 72.65,41.54 v72.35,41.24 | v49.53,100.33 49.53,99.09 R54.2 | v59.69,100.33 60.33,99.69 60.33,91.76 58.96,90.39 58.96,41.05 59.04,40.97 59.2,40.97 59.56,40.61 v59.86,40.61
  Top 0.203: R54.2 48.87,99.03 48.26,98.42 48.26,94.93 45.05,91.72 LAN8742A.12
  Bottom 0.152: v72.35,41.24 72.35,40.92 72.01,40.58 | 72.01,40.58 | 72.01,40.58 71.74,40.31 60.16,40.31 v59.86,40.61 | v59.69,100.33 v49.53,100.33
ETH_REF_CLK  (via drill 0.35)
  Top 0.152: U$3.PA1 73.5,48.22 72.35,47.06 72.35,42.19 71.44,41.28 v71.44,40.96 | v59.57,41.52 59.27,41.82 59.27,89.95 60.93,91.62 60.93,100.37 v60.33,100.97 | v46.99,100.65 47.04,100.59 R48.2
  Bottom 0.152: v71.44,40.96 71.1,40.62 60.98,40.62 60.08,41.52 v59.57,41.52 | v60.33,100.97 47.31,100.97 v46.99,100.65
ETH_RXD0  (via drill 0.35)
  Top 0.152: U$3.PC4 80.98,37.1 v80.36,36.48 | v51.45,36.79 51.14,37.09 51.14,65.63 52.69,67.18 52.69,67.93 52.7,67.94 52.7,88.58 52.04,89.25 R38.2
  Bottom 0.152: v80.36,36.48 80.06,36.18 53.69,36.18 53.68,36.2 52.04,36.2 v51.45,36.79
ETH_RXD1  (via drill 0.35)
  Top 0.152: U$3.PC5 81.48,36.38 v81.27,36.17 | v51.14,35.88 50.84,36.18 50.84,65.76 52.39,67.31 52.39,84.45 51.91,84.93 51.2,84.93 R37.2
  Bottom 0.152: v81.27,36.17 80.98,35.88 v51.14,35.88
ETH_TX_EN  (via drill 0.35)
  Top 0.152: U$3.PB11 93.98,42.51 93.4,41.93 93.4,38.05 v93.98,37.47 | v55.84,37.78 55.54,38.08 55.54,54.98 54.8,55.71 54.8,64.12 56.38,65.69 56.38,76.02 56.98,76.63 56.98,80.5 55.46,82.02 55.46,91.97 56.52,93.03 v56.52,97.47 | LAN8742A.16 41.73,95.13 v41.28,95.58
  Bottom 0.152: v93.98,37.47 93.03,38.42 75.56,38.42 74.61,37.47 56.16,37.47 v55.84,37.78 | v56.52,97.47 56.49,97.44 53.09,97.44 51.21,95.57 41.29,95.57 v41.28,95.58
ETH_TXD0  (via drill 0.35)
  Top 0.152: U$3.PB12 102.81,48.22 v102.98,48.05 | v117.16,48.26 v117.16,91.12 | LAN8742A.17 41.23,94.34 v40.64,94.93
  Bottom 0.152: v102.98,48.05 116.95,48.05 v117.16,48.26 | v117.16,91.12 56.2,91.12 52.7,94.61 43.72,94.61 43.43,94.33 41.25,94.33 v40.64,94.93
ETH_TXD1  (via drill 0.35)
  Top 0.152: U$3.PB13 103.59,48.72 v103.66,48.66 | v116.55,48.94 116.85,49.24 116.85,90.14 v116.52,90.48 | LAN8742A.18 40.73,93.93 v39.73,94.93
  Bottom 0.152: v103.66,48.66 103.96,48.35 115.97,48.35 v116.55,48.94 | v116.52,90.48 116.19,90.81 56.08,90.81 52.58,94.31 43.85,94.31 43.56,94.02 40.64,94.02 v39.73,94.93
FLASH_CS
  Top 0.152: U$3.PA5 79.48,45.61 79.06,46.04 78.11,46.99 76.52,46.99 75.56,46.04 74.3,46.04 73.66,45.4 73.66,40.15 73.87,39.94 73.87,38.94 72.71,37.78 66.99,37.78 65.41,36.2 65.41,21.91 64.96,21.46 U$4.7
FLASH_MISO
  Top 0.152: U$3.PC2 74.52,51.75 70.17,51.75 69.22,52.7 66.24,52.7 63.84,50.3 U$4.8
FLASH_MOSI  (via drill 0.35)
  Top 0.152: U$3.PC3 70.07,51.22 68.9,52.39 66.36,52.39 64.45,50.48 v64.45,25.4 | U$4.15 52.2,15.11 51.47,15.84 51.47,25.12 v51.75,25.4
  Bottom 0.152: v64.45,25.4 v51.75,25.4
FLASH_SCK  (via drill 0.35)
  Top 0.152: U$3.PD3 91.98,78.97 v92.08,79.06 | v55.76,78.74 55.46,78.44 55.46,66.07 53.89,64.5 53.89,55.33 54.61,54.61 54.61,51.44 53.28,50.1 53.28,39.75 54.38,38.65 54.38,35.01 50.84,31.47 50.84,31.43 50.84,14.88 51.88,13.84 U$4.16
  Bottom 0.152: v92.08,79.06 56.08,79.06 v55.76,78.74
FMC_A0  (via drill 0.35)
  Top 0.152: U$3.PF0 65.23,60.72 61.66,57.15 61.66,33.08 60.52,31.95 v60.52,31.14 | v79.7,30.8 79.7,21.98 U$1.23
  Bottom 0.152: v60.52,31.14 60.52,31.63 60.96,32.07 60.97,32.06 61.68,32.06 62.59,31.16 63.69,31.16 64.39,30.45 77.01,30.45 77.63,31.07 78.58,31.07 78.85,30.8 v79.7,30.8
FMC_A1  (via drill 0.35)
  Top 0.152: U$3.PF1 70,60.22 69.97,60.25 65.19,60.25 61.96,57.02 61.96,31.99 v61.43,31.45 | U$1.24 78.88,29.98 v79.06,30.16
  Bottom 0.152: v61.43,31.45 62.04,30.85 63.56,30.85 64.26,30.15 77.14,30.15 77.76,30.77 78.45,30.77 v79.06,30.16
FMC_A2  (via drill 0.35)
  Top 0.152: U$3.PF2 70.07,59.72 69.84,59.94 65.32,59.94 62.27,56.89 62.27,31.43 61.38,30.55 v61.21,30.55 | v78.11,30.16 78.11,21.98 U$1.25
  Bottom 0.152: v61.21,30.55 63.43,30.55 64.14,29.84 77.79,29.84 v78.11,30.16
FMC_A3  (via drill 0.35)
  Top 0.152: U$3.PF3 70.14,59.22 69.72,59.64 65.44,59.64 62.57,56.77 62.57,31.05 61.33,29.81 v61.33,28.57 | v77.15,28.57 77.28,28.45 U$1.26
  Bottom 0.152: v61.33,28.57 v77.15,28.57
FMC_A4  (via drill 0.35)
  Top 0.152: U$3.PF4 70.2,58.72 69.59,59.33 65.57,59.33 62.88,56.64 62.88,30.92 61.94,29.99 61.94,27.02 v61.91,26.98 | v73.51,27.62 71.95,26.07 71.95,10.28 74.3,7.94 76.52,7.94 77.28,8.7 U$1.29
  Bottom 0.152: v61.91,26.98 61.94,27.02 62.8,27.02 63.09,27.3 72.06,27.3 72.35,27.02 72.9,27.02 v73.51,27.62
FMC_A5  (via drill 0.35)
  Top 0.152: U$3.PF5 70.27,58.22 69.47,59.03 65.69,59.03 63.18,56.52 63.18,30.8 62.55,30.16 v62.55,27.62 | v72.6,27.62 71.65,26.67 71.65,9.63 73.98,7.3 76.83,7.3 78.08,8.55 U$1.30
  Bottom 0.152: v62.55,27.62 v72.6,27.62
FMC_A6  (via drill 0.35)
  Top 0.152: U$3.PF12 83.98,41.84 83.42,41.27 83.42,33.72 84.19,32.95 84.19,31.55 v84.16,31.52 | v71.99,31.43 71.04,30.48 71.04,9.21 73.58,6.67 77.07,6.67 78.88,8.47 U$1.31
  Bottom 0.152: v84.16,31.52 72.08,31.52 v71.99,31.43
FMC_A7  (via drill 0.35)
  Top 0.152: U$3.PF13 85.48,42.07 85.96,41.59 v85.96,33.66 | v70.09,33.66 70.09,8.26 72.63,5.71 78.03,5.71 79.68,7.37 U$1.32
  Bottom 0.152: v85.96,33.66 v70.09,33.66
FMC_A8  (via drill 0.35)
  Top 0.152: U$3.PF14 85.98,42 86.27,41.72 86.27,34.63 v86.61,34.3 | v69.14,33.66 69.78,33.01 69.78,7.92 72.31,5.4 78.34,5.4 80.48,7.54 U$1.33
  Bottom 0.152: v86.61,34.3 85.65,34.3 85.31,33.96 70.64,33.96 70.34,34.26 69.74,34.26 v69.14,33.66
FMC_A9  (via drill 0.35)
  Top 0.152: U$3.PF15 86.48,42.25 86.6,42.14 86.6,35.24 87.21,34.63 87.21,33.73 v86.87,33.39 | U$1.34 81.31,11.03 81.31,7.73 78.66,5.08 72.94,5.08 72.93,5.09 72.18,5.09 69.45,7.82 69.45,32.43 v69.14,32.75
  Bottom 0.152: v86.87,33.39 86.53,33.05 85.71,33.05 85.42,33.34 70.72,33.34 70.13,32.75 v69.14,32.75
FMC_A10  (via drill 0.35)
  Top 0.152: U$3.PG0 86.98,35.29 87.52,34.75 87.52,34.59 v87.82,34.29 | v80.25,34.61 80.64,34.21 v80.64,25.4 | v80.64,24.13 80.48,23.96 U$1.22
  Bottom 0.152: v87.82,34.29 87.47,34.29 86.86,34.9 85.83,34.9 85.19,34.27 80.59,34.27 v80.25,34.61 | v80.64,25.4 69.85,25.4 68.9,24.45 68.9,23.5 69.85,22.54 70.74,22.54 arc-90 71,22.28 71,21.93 arc90 71.27,21.66 71.34,21.66 arc90 71.6,21.93 71.6,23.15 arc-90 71.87,23.42 71.94,23.42 arc-90 72.2,23.15 72.2,21.93 arc90 72.47,21.66 72.53,21.66 arc90 72.8,21.93 72.8,23.15 arc-90 73.07,23.42 73.13,23.42 arc-90 73.4,23.15 73.4,21.93 arc90 73.67,21.66 73.73,21.66 arc90 74,21.93 74,23.15 arc-90 74.27,23.42 74.33,23.42 arc-90 74.6,23.15 74.6,21.93 arc90 74.86,21.66 74.93,21.66 arc90 75.2,21.93 75.2,23.15 arc-90 75.46,23.42 75.53,23.42 arc-90 75.8,23.15 75.8,21.93 arc90 76.06,21.66 76.13,21.66 arc90 76.39,21.93 76.39,23.15 arc-90 76.66,23.42 76.73,23.42 arc-90 76.99,23.15 76.99,21.93 arc90 77.26,21.66 77.33,21.66 arc90 77.59,21.93 77.59,23.15 arc-90 77.86,23.42 77.92,23.42 arc-90 78.19,23.15 78.19,21.93 arc90 78.46,21.66 78.52,21.66 arc90 78.79,21.93 78.79,22.28 arc-90 79.06,22.54 v80.64,24.13
FMC_A11  (via drill 0.35)
  Top 0.152: v87.87,33.38 87.87,33.48 88.43,34.04 88.43,34.54 87.48,35.48 U$3.PG1 | v68.85,31.84 68.85,31.4 69.14,31.11 69.14,7.71 72.06,4.79 72.81,4.79 72.82,4.78 78.99,4.78 82.08,7.87 U$1.35
  Bottom 0.152: v87.87,33.38 87.19,32.7 85.63,32.7 85.31,33.02 70.84,33.02 69.95,32.14 69.15,32.14 v68.85,31.84
FMC_BA0  (via drill 0.35)
  Top 0.152: U$3.PG4 107.52,56.22 110.04,53.7 110.04,36.15 111.02,35.18 v111.02,27.94 | U$1.20 82.08,27.75 v82.27,27.94
  Bottom 0.152: v111.02,27.94 v82.27,27.94
FMC_BA1  (via drill 0.35)
  Top 0.152: U$3.PG5 107.45,56.72 110.34,53.83 110.34,36.28 111.62,35 111.62,27.69 111.02,27.08 v111.02,26.99 | U$1.21 v81.28,27.94
  Bottom 0.152: v111.02,26.99 110.81,26.99 110.17,27.62 82.81,27.62 82.53,27.33 81.89,27.33 v81.28,27.94
FMC_D0  (via drill 0.35)
  Top 0.152: U$3.PD14 103.11,54.22 103.5,54.61 108.27,54.61 109.43,53.45 v109.43,30.48 | U$1.2 96.48,29.8 v96.84,30.16
  Bottom 0.152: v109.43,30.48 108.8,30.48 108.22,29.9 107.06,29.9 106.48,30.48 97.16,30.48 v96.84,30.16
FMC_D1  (via drill 0.35)
  Top 0.152: U$3.PD15 102.98,54.72 103.19,54.93 108.38,54.93 109.73,53.57 109.73,31.03 110.04,30.73 110.04,30.23 109.43,29.62 v109.43,29.53 | U$1.4 94.88,24.18 94.61,24.45 94.61,28.89 v95.25,29.53
  Bottom 0.152: v109.43,29.53 v95.25,29.53
FMC_D2  (via drill 0.35)
  Top 0.152: U$3.PD0 93.48,76.64 v93.67,76.83 | v113.64,76.56 113.35,76.27 113.35,53.77 114.61,52.51 114.61,33.98 114.62,33.97 114.62,27.94 115.25,27.3 115.25,26.67 v114.3,25.72 | U$1.5 94.08,26.57 v93.98,26.67
  Bottom 0.152: v93.67,76.83 94,77.15 112.79,77.15 113.08,76.86 113.33,76.86 v113.64,76.56 | v114.3,25.72 110.38,25.72 109.08,27.01 94.32,27.01 v93.98,26.67
FMC_D3  (via drill 0.35)
  Top 0.152: U$3.PD1 92.98,77.42 v93.03,77.47 | v113.33,77.47 113.33,77.45 113.03,77.15 113.03,53.66 114.3,52.39 v114.3,26.67 | v92.6,26.99 92.48,26.87 U$1.7
  Bottom 0.152: v114.3,26.67 113.98,26.35 110.17,26.35 109.21,27.32 92.93,27.32 v92.6,26.99 | v93.03,77.47 v113.33,77.47
FMC_D4  (via drill 0.35)
  Top 0.152: v88.78,33.34 88.73,33.38 88.73,34.67 87.79,35.61 87.79,41.75 87.98,41.95 U$3.PE7 | U$1.8 91.68,25.92 v91.8,26.04 | v106.89,26.35 106.89,30.07 106.7,30.26 106.7,32.72 v107,33.02
  Bottom 0.152: v107,33.02 106.68,33.34 arc90 106.41,33.07 106.41,32.38 arc-90 106.15,32.12 106.1,32.12 arc-90 105.84,32.38 105.84,34.29 arc90 105.57,34.56 105.53,34.56 arc90 105.26,34.29 105.26,32.38 arc-90 105,32.12 104.95,32.12 arc-90 104.69,32.38 104.69,34.29 arc90 104.42,34.56 104.38,34.56 arc90 104.11,34.29 104.11,32.38 arc-90 103.84,32.12 103.8,32.12 arc-90 103.53,32.38 103.53,34.29 arc90 103.27,34.56 103.23,34.56 arc90 102.96,34.29 102.96,32.38 arc-90 102.69,32.12 102.65,32.12 arc-90 102.38,32.38 102.38,34.29 arc90 102.12,34.56 102.07,34.56 arc90 101.81,34.29 101.81,32.38 arc-90 101.54,32.12 101.5,32.12 arc-90 101.23,32.38 101.23,33.07 arc90 100.97,33.34 v88.78,33.34 | v106.89,26.35 106.57,26.04 v91.8,26.04
FMC_D5  (via drill 0.35)
  Top 0.152: U$3.PE8 88.48,41.81 88.13,41.46 88.13,35.93 89.77,34.29 89.77,24.87 v90.22,24.42 | v92.08,19.37 91.44,19.37 90.08,20.73 U$1.10
  Bottom 0.152: v90.22,24.42 91.36,24.42 arc-90 91.63,24.16 arc90 91.9,23.89 93.22,23.89 arc90 93.49,24.16 93.49,24.69 arc-90 93.75,24.95 95.07,24.95 arc-90 95.34,24.69 95.34,24.16 arc90 95.61,23.89 96.93,23.89 arc90 97.19,24.16 97.19,24.69 arc-90 97.46,24.95 98.78,24.95 arc-90 99.05,24.69 99.05,24.16 arc90 99.31,23.89 100.64,23.89 arc90 100.9,24.16 100.9,24.69 arc-90 101.17,24.95 102.49,24.95 arc-90 102.76,24.69 102.76,24.16 arc90 103.02,23.89 104.34,23.89 arc90 104.61,24.16 104.61,24.69 arc-90 104.88,24.95 106.2,24.95 arc-90 106.46,24.69 106.46,24.16 arc90 106.73,23.89 108.05,23.89 arc90 108.32,24.16 arc-90 108.58,24.42 109.56,24.42 110.81,23.18 110.81,20 109.54,18.73 92.71,18.73 v92.08,19.37
FMC_D6  (via drill 0.35)
  Top 0.152: v90.41,28.89 90.41,34.29 88.48,36.22 88.48,41.38 88.98,41.88 U$3.PE9 | U$1.11 89.28,19.94 90.81,18.41 92.71,18.41 v93.66,19.37 | v89.22,24.13 89.14,24.21 v89.14,28.89
  Bottom 0.152: v90.41,28.89 v89.14,28.89 | v93.66,19.37 108.9,19.37 110.17,20.64 110.17,21.27 109.54,21.91 109.22,21.91 arc90 108.95,21.64 arc-90 108.69,21.37 106.85,21.37 arc-90 106.58,21.64 106.58,22.17 arc90 106.31,22.44 104.48,22.44 arc90 104.21,22.17 104.21,21.64 arc-90 103.94,21.37 102.1,21.37 arc-90 101.84,21.64 101.84,22.17 arc90 101.57,22.44 99.73,22.44 arc90 99.47,22.17 99.47,21.64 arc-90 99.2,21.37 97.36,21.37 arc-90 97.09,21.64 97.09,22.17 arc90 96.83,22.44 94.99,22.44 arc90 94.72,22.17 94.72,21.64 arc-90 94.45,21.37 92.62,21.37 arc-90 92.35,21.64 arc90 92.08,21.91 91.44,21.91 v89.22,24.13
FMC_D7  (via drill 0.35)
  Top 0.152: U$3.PE10 90.48,42.47 91.04,41.91 v91.04,29.84 | v87.23,29.84 87.95,29.13 87.95,24.77 87.86,24.67 v87.86,24.45 | U$1.13 87.68,19.69 v87.63,19.64
  Bottom 0.152: v91.04,29.84 v87.23,29.84 | v87.86,24.45 83.19,24.45 79.69,20.95 74.61,20.95 74.3,20.64 74.3,18.1 74.62,18.1 arc-90 74.89,17.83 74.89,17.5 arc90 75.15,17.24 75.24,17.24 arc90 75.5,17.5 75.5,18.69 arc-90 75.77,18.96 75.85,18.96 arc-90 76.12,18.69 76.12,17.5 arc90 76.38,17.24 76.47,17.24 arc90 76.73,17.5 76.73,18.69 arc-90 77,18.96 77.08,18.96 arc-90 77.35,18.69 77.35,17.5 arc90 77.61,17.24 77.69,17.24 arc90 77.96,17.5 77.96,18.69 arc-90 78.23,18.96 78.31,18.96 arc-90 78.58,18.69 78.58,17.5 arc90 78.84,17.24 78.92,17.24 arc90 79.19,17.5 79.19,18.69 arc-90 79.46,18.96 79.54,18.96 arc-90 79.8,18.69 79.8,17.5 arc90 80.07,17.24 80.15,17.24 arc90 80.42,17.5 80.42,18.69 arc-90 80.69,18.96 80.77,18.96 arc-90 81.03,18.69 81.03,17.5 arc90 81.3,17.24 81.38,17.24 arc90 81.65,17.5 81.65,17.83 arc-90 81.92,18.1 86.09,18.1 v87.63,19.64
FMC_D8  (via drill 0.35)
  Top 0.152: U$3.PE11 91.04,44.73 91.04,42.34 91.36,42.02 91.36,34.92 92.63,33.66 v92.63,31.43 | v108.82,31.43 108.82,7.94 104.38,3.49 89.14,3.49 86.36,6.27 86.36,7.94 87.68,9.26 U$1.42
  Bottom 0.152: v92.63,31.43 v108.82,31.43
FMC_D9  (via drill 0.35)
  Top 0.152: U$3.PE12 91.48,42.33 91.67,42.15 91.67,35.05 93.24,33.48 93.24,31.13 v92.63,30.52 | 108.5,30.48 v108.23,30.75 v108.22,30.75 108.5,30.46 108.5,8.05 104.26,3.81 92,3.81 89.77,6.03 89.77,8.26 89.28,8.75 U$1.44
  Bottom 0.152: v92.63,30.52 93.22,31.11 107.86,31.11 v108.22,30.75
FMC_D10  (via drill 0.35)
  Top 0.152: U$3.PE13 91.98,35.26 93.54,33.7 93.54,30.58 92.63,29.67 v92.63,29.53 | v107.31,30.51 107.65,30.16 107.87,30.16 108.2,29.83 108.2,8.27 104.06,4.13 92.11,4.13 90.15,6.09 90.15,10.99 U$1.45
  Bottom 0.152: v92.63,29.53 93.9,30.8 107.02,30.8 v107.31,30.51
FMC_D11  (via drill 0.35)
  Top 0.152: v92.63,35.56 92.48,35.71 U$3.PE14 | v106.28,35.56 106.28,6.99 103.74,4.45 93.27,4.45 91.68,6.03 U$1.47
  Bottom 0.152: v92.63,35.56 v106.28,35.56
FMC_D12  (via drill 0.35)
  Top 0.152: v105.64,36.2 105.68,36.17 105.68,35.31 105.97,35.02 105.97,7.1 103.62,4.75 93.91,4.75 92.48,6.18 U$1.48 | U$3.PE15 92.98,42.42 92.79,42.23 92.79,36.69 v93.11,36.36
  Bottom 0.152: v93.11,36.36 93.6,35.88 105.31,35.88 v105.64,36.2
FMC_D13  (via drill 0.35)
  Top 0.152: U$3.PD8 105.04,50.22 v105.09,50.16 | v113.67,50.16 v113.67,7.94 | v94.3,8.63 94.08,8.85 U$1.50
  Bottom 0.152: v105.09,50.16 v113.67,50.16 | v113.67,7.94 94.99,7.94 v94.3,8.63
FMC_D14  (via drill 0.35)
  Top 0.152: U$3.PD9 104.35,50.72 v104.46,50.82 | v113.02,50.81 113.06,50.77 113.06,49.91 113.35,49.62 113.35,8.9 v112.99,8.54 | v95.21,8.63 94.88,8.95 U$1.51
  Bottom 0.152: v104.46,50.82 113.01,50.82 v113.02,50.81 | v112.99,8.54 112.7,8.26 95.58,8.26 v95.21,8.63
FMC_D15  (via drill 0.35)
  Top 0.152: U$3.PD10 103.08,51.22 v103.19,51.32 | v113.67,51.44 113.64,51.41 112.77,51.41 112.42,51.06 112.42,50.12 113.03,49.51 113.03,9.74 v112.74,9.45 | v96.52,8.89 96.48,8.93 U$1.53
  Bottom 0.152: v103.19,51.32 103.3,51.44 v113.67,51.44 | v112.74,9.45 111.86,8.57 96.84,8.57 v96.52,8.89
FMC_NBL0  (via drill 0.35)
  Top 0.152: U$3.PE0 79.98,78 v80.09,78.11 | v56.37,76.88 56.07,76.58 56.07,65.82 54.5,64.25 54.5,55.59 55.23,54.85 55.23,27.95 55.88,27.3 v55.88,26.31 | U$1.15 86.08,26.16 v85.89,26.35
  Bottom 0.152: v80.09,78.11 79.77,77.79 57.28,77.79 v56.37,76.88 | v55.88,26.31 56.16,26.04 63.8,26.04 64.08,26.31 64.83,26.31 65.11,26.04 85.57,26.04 v85.89,26.35
FMC_NBL1  (via drill 0.35)
  Top 0.152: U$3.PE1 79.48,78.03 v79.06,78.45 | v56.07,77.79 55.77,77.49 55.77,65.95 54.19,64.37 54.19,55.46 54.91,54.74 54.91,35.57 54.93,35.56 v54.93,26.01 | v67.31,23.18 67.94,22.54 67.94,19.05 v68.26,18.73 | v84.77,14.29 85.28,13.78 U$1.39
  Bottom 0.152: v79.06,78.45 56.73,78.45 v56.07,77.79 | v54.93,26.01 55.23,25.7 63.9,25.7 64.2,26.01 64.7,26.01 65.06,25.65 65.06,25.43 v67.31,23.18 | v68.26,18.73 72.71,14.29 v84.77,14.29
FMC_SDCKE1  (via drill 0.35)
  Top 0.152: U$3.PH7 95.98,43.12 98.04,41.06 98.04,37.7 97.74,37.4 97.74,36.9 98.04,36.59 98.04,34.99 v98,34.95 | v110.41,34.92 110.41,7.62 105.97,3.17 85.96,3.17 83.68,5.46 U$1.37
  Bottom 0.152: v98,34.95 110.38,34.95 v110.41,34.92
FMC_SDCLK  (via drill 0.35)
  Top 0.152: U$3.PG8 107.43,58.22 107.63,58.42 109.22,58.42 110.65,56.99 110.65,36.41 111.93,35.13 111.93,4.61 v111.76,4.45 | v85.48,4.52 84.48,5.52 U$1.38
  Bottom 0.152: v111.76,4.45 85.55,4.45 v85.48,4.52
FMC_SDNCAS  (via drill 0.35)
  Top 0.152: U$1.17 84.48,25.38 v84.45,25.4 | v118.43,26.04 118.43,36.83 117.47,37.78 117.47,47.72 117.76,48.01 117.76,52.1 117.46,52.4 117.46,75.23 v118.11,75.88 | v84.14,75.56 84.48,75.22 U$3.PG15
  Bottom 0.152: v84.45,25.4 113.76,25.4 114.05,25.11 117.5,25.11 v118.43,26.04 | v118.11,75.88 84.45,75.88 v84.14,75.56
FMC_SDNE1  (via drill 0.35)
  Top 0.152: U$3.PH6 95.48,43.19 97.73,40.93 97.73,37.83 97.39,37.48 97.39,32.7 97.43,32.66 99.38,30.72 99.38,30.37 arc-90 99.11,30.11 arc90 98.84,29.84 98.84,29.81 arc90 99.11,29.54 99.64,29.54 arc-90 99.91,29.27 99.91,29.25 arc-90 99.64,28.98 99.11,28.98 arc90 98.84,28.71 98.84,28.68 arc90 99.11,28.41 99.64,28.41 arc-90 99.91,28.15 99.91,28.12 arc-90 99.64,27.85 99.11,27.85 arc90 98.84,27.58 98.84,27.55 arc90 99.11,27.29 99.64,27.29 arc-90 99.91,27.02 99.91,26.99 arc-90 99.64,26.72 99.11,26.72 arc90 98.84,26.46 98.84,26.43 arc90 99.11,26.16 99.64,26.16 arc-90 99.91,25.89 99.91,25.86 arc-90 99.64,25.59 99.11,25.59 arc90 98.84,25.33 98.84,25.3 arc90 99.11,25.03 arc-90 99.38,24.77 99.38,22.86 100.01,22.23 100.33,22.23 100.65,22.54 100.65,30.8 v98.74,32.7 | U$1.19 82.88,32.16 v83.11,32.38
  Bottom 0.152: v83.11,32.38 85.33,32.38 85.34,32.4 87.31,32.4 87.62,32.7 v98.74,32.7
FMC_SDNRAS  (via drill 0.35)
  Top 0.152: U$3.PF11 83.48,41.97 83.11,41.59 83.11,33.24 83.71,32.64 83.71,32.13 83.42,31.84 83.42,31.39 83.91,30.91 84.41,30.91 84.93,31.43 v85.07,31.43 | v100.33,32.07 101.25,31.14 v101.25,28.57 | U$1.18 83.68,28.37 v83.5,28.55
  Bottom 0.152: v83.5,28.55 88.62,28.55 88.89,28.29 100.97,28.29 v101.25,28.57 | v85.07,31.43 85.38,31.11 85.41,31.11 arc90 85.67,31.38 arc-90 85.94,31.65 86.01,31.65 arc-90 86.28,31.38 86.28,30.85 arc90 86.54,30.58 86.61,30.58 arc90 86.88,30.85 86.88,31.38 arc-90 87.14,31.65 87.21,31.65 arc-90 87.48,31.38 87.48,30.85 arc90 87.75,30.58 87.82,30.58 arc90 88.08,30.85 88.08,31.38 arc-90 88.35,31.65 88.42,31.65 arc-90 88.69,31.38 88.69,30.85 arc90 88.95,30.58 89.02,30.58 arc90 89.29,30.85 89.29,31.38 arc-90 89.55,31.65 89.62,31.65 arc-90 89.89,31.38 89.89,30.85 arc90 90.16,30.58 90.22,30.58 arc90 90.49,30.85 90.49,31.38 arc-90 90.76,31.65 90.83,31.65 arc-90 91.09,31.38 arc90 91.36,31.11 91.44,31.11 92.39,32.07 v100.33,32.07
FMC_SDNWE  (via drill 0.35)
  Top 0.152: U$3.PC0 70.47,52.72 69.85,53.34 64.77,53.34 63.5,52.07 63.5,29.8 v63.23,29.53 | U$1.16 85.28,29.34 v85.09,29.53
  Bottom 0.152: v63.23,29.53 v85.09,29.53
GND  (via drill 0.35)
  Top 0.305: LAN8742A.25 41.37,91.08 v41.35,91.08